# EAGLE design SuperPET OS9 MMU v2.0 (EAGLE 5.02)
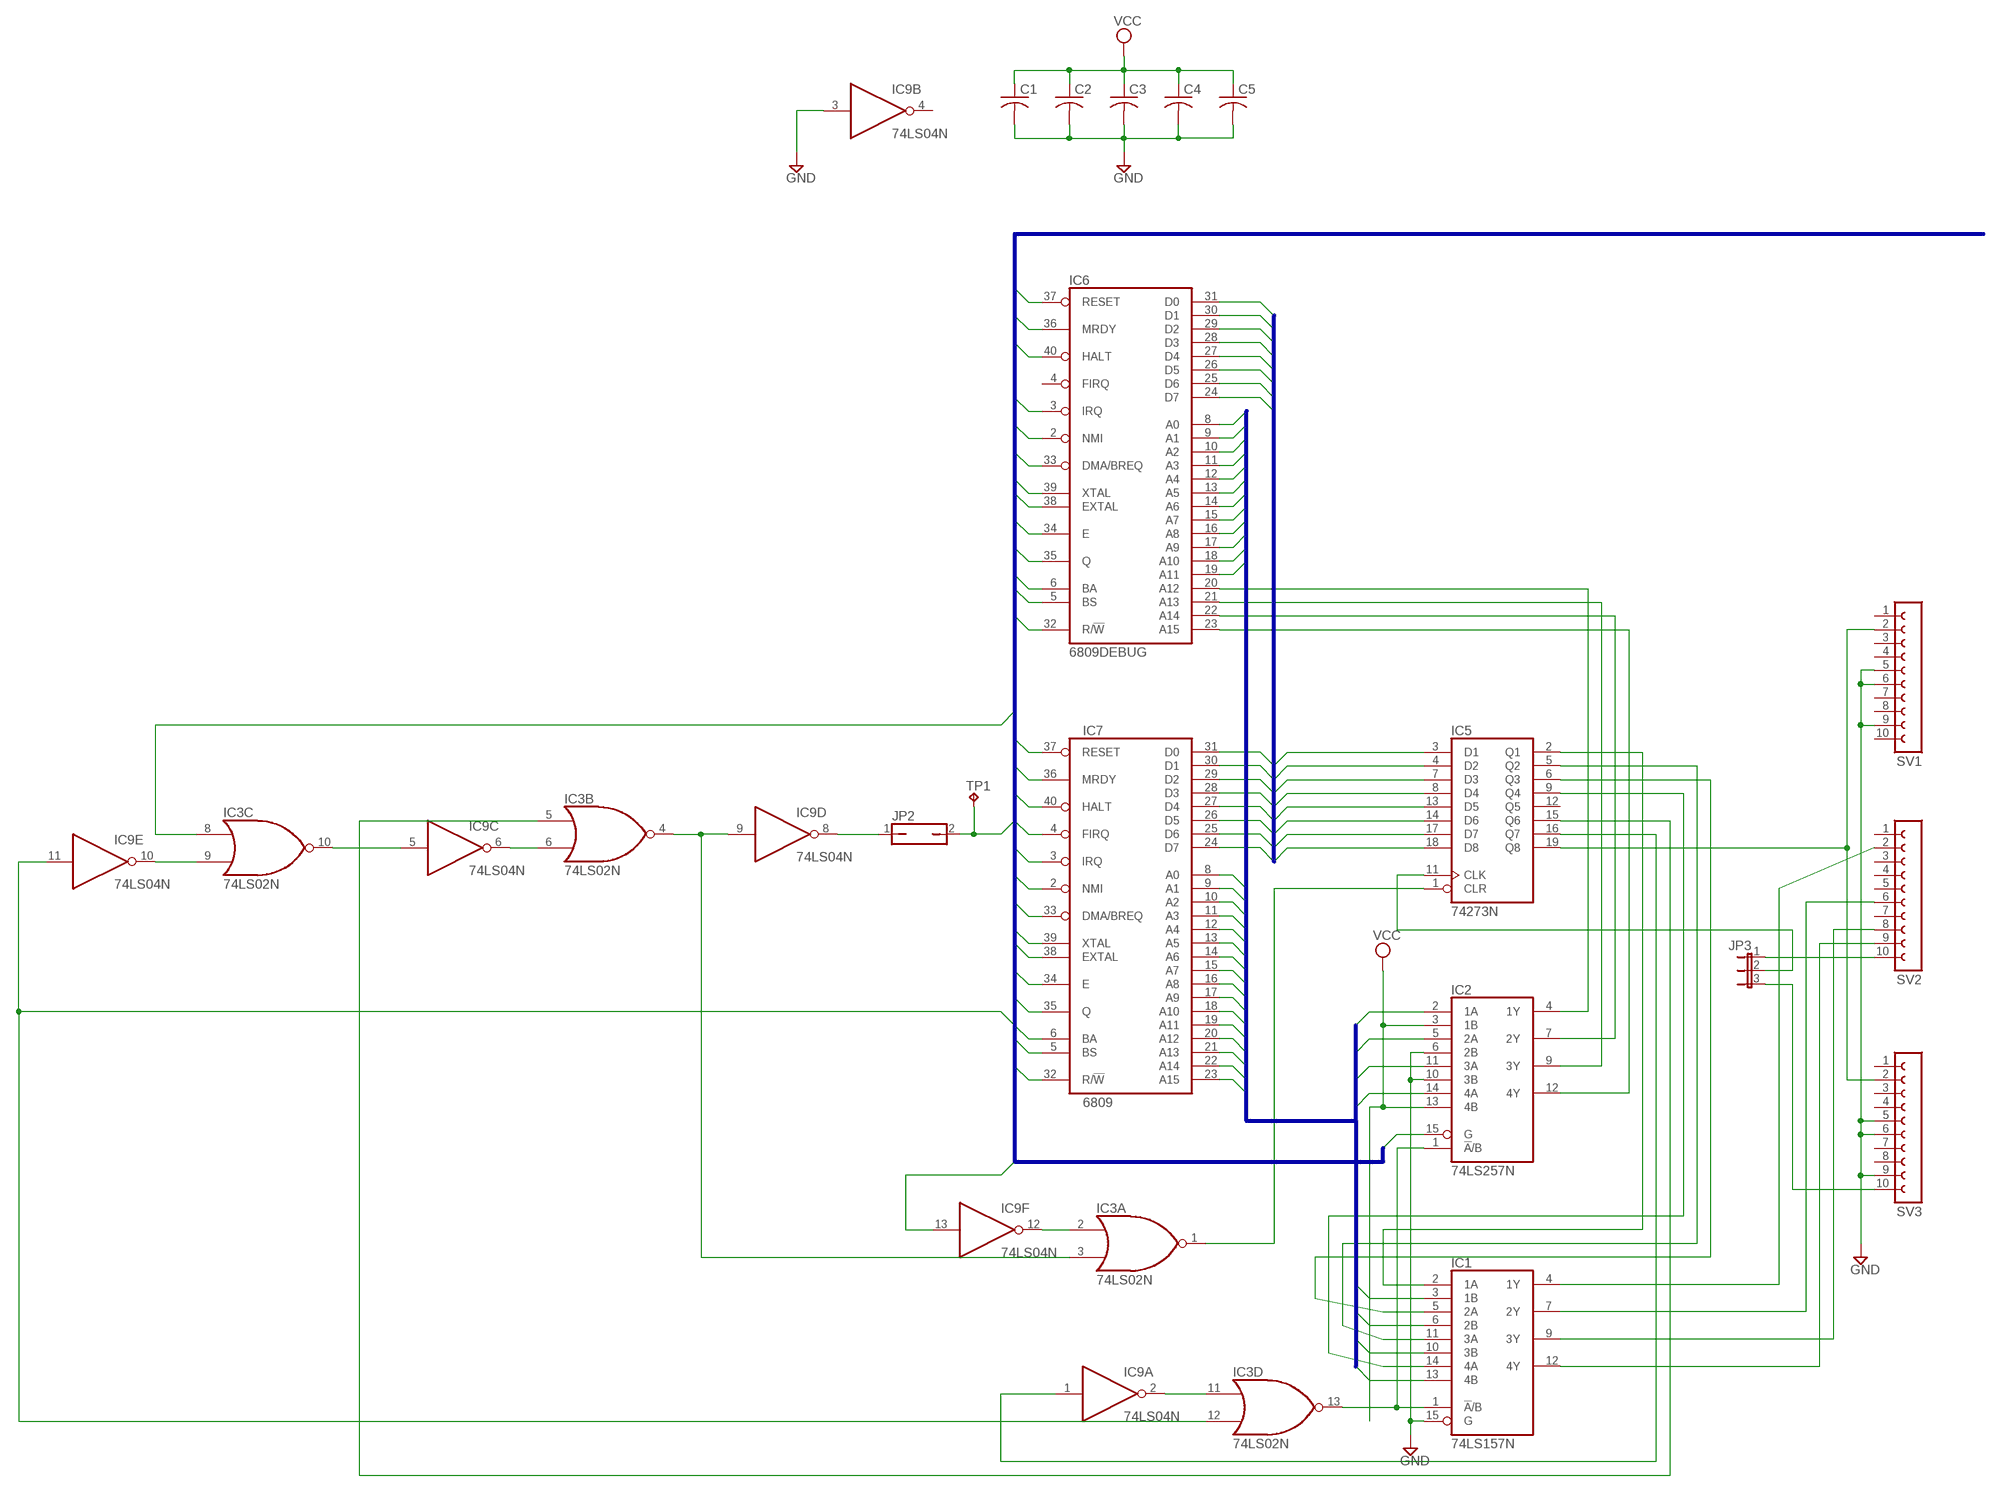
[diagram p0: schematic, sheet 1]

## Parts
C1  C-US025-025X050  [C025-025X050]
C2  C-US025-025X050  [C025-025X050]
C3  C-US025-025X050  [C025-025X050]
C4  C-US025-025X050  [C025-025X050]
C5  C-US025-025X050  [C025-025X050]
IC1  74LS157N  [DIL16]
IC2  74LS257N  [DIL16]
IC3  74LS02N  [DIL14]
IC5  74273N  [DIL20]
IC6  6809DEBUG  [DIL40]
IC7  6809  [DIL40]
IC9  74LS04N  [DIL14]
JP2  JP1Q  [JP1]
JP3  JP2E  [JP2]
SV1  FE10-1  [FE10]
SV2  FE10-1  [FE10]
SV3  FE10-1  [FE10]
TP1  TPPAD1-17  [P1-17]

## Nets
ADDR0: IC6.8(A0) IC7.8(A0)
ADDR1: IC6.9(A1) IC7.9(A1)
ADDR2: IC6.10(A2) IC7.10(A2)
ADDR3: IC6.11(A3) IC7.11(A3)
ADDR4: IC6.12(A4) IC7.12(A4)
ADDR5: IC6.13(A5) IC7.13(A5)
ADDR6: IC6.14(A6) IC7.14(A6)
ADDR7: IC6.15(A7) IC7.15(A7)
ADDR8: IC6.16(A8) IC7.16(A8)
ADDR9: IC6.17(A9) IC7.17(A9)
ADDR10: IC6.18(A10) IC7.18(A10)
ADDR11: IC6.19(A11) IC7.19(A11)
ADDR12: IC1.3(1B) IC2.2(1A) IC7.20(A12)
ADDR13: IC1.10(3B) IC2.11(3A) IC7.21(A13)
ADDR14: IC1.6(2B) IC2.5(2A) IC7.22(A14)
ADDR15: IC1.13(4B) IC2.14(4A) IC7.23(A15)
BA: IC2.15(G) IC3.12(D:I1) IC6.6(BA) IC7.6(BA) IC9.11(E:I)
BS: IC3.8(C:I0) IC6.5(BS) IC7.5(BS)
DATA0: IC5.3(D1) IC6.31(D0) IC7.31(D0)
DATA1: IC5.4(D2) IC6.30(D1) IC7.30(D1)
DATA2: IC5.7(D3) IC6.29(D2) IC7.29(D2)
DATA3: IC5.8(D4) IC6.28(D3) IC7.28(D3)
DATA4: IC5.13(D5) IC6.27(D4) IC7.27(D4)
DATA5: IC5.14(D6) IC6.26(D5) IC7.26(D5)
DATA6: IC5.17(D7) IC6.25(D6) IC7.25(D6)
DATA7: IC5.18(D8) IC6.24(D7) IC7.24(D7)
DMA: IC6.33(DMA/BREQ) IC7.33(DMA/BREQ)
E: IC6.34(E) IC7.34(E)
EXTAL: IC6.38(EXTAL) IC7.38(EXTAL)
FIRQ: IC7.4(FIRQ) JP2.2 TP1.1(TP)
GND: C1.2 C2.2 C3.2 C4.2 C5.2 IC1.15(G) IC2.6(2B) IC2.10(3B) IC9.3(B:I) SV1.5 SV1.6 SV1.9 SV3.5 SV3.6 SV3.9
HALT: IC6.40(HALT) IC7.40(HALT)
IRQ: IC6.3(IRQ) IC7.3(IRQ)
MRDY: IC6.36(MRDY) IC7.36(MRDY)
N$1: IC2.4(1Y) IC6.20(A12)
N$2: IC2.9(3Y) IC6.21(A13)
N$3: IC2.7(2Y) IC6.22(A14)
N$4: IC2.12(4Y) IC6.23(A15)
N$5: IC1.1(!A!/B) IC2.1(!A!/B) IC3.13(D:O)
N$6: IC3.1(A:O) IC5.1(CLR)
N$7: IC3.2(A:I0) IC9.12(F:O)
N$8: IC9.8(D:O) JP2.1
N$9: IC3.3(A:I1) IC3.4(B:O) IC9.9(D:I)
N$10: IC3.5(B:I0) IC5.15(Q6)
N$11: IC3.6(B:I1) IC9.6(C:O)
N$12: IC3.10(C:O) IC9.5(C:I)
N$13: IC3.9(C:I1) IC9.10(E:O)
N$14: IC3.11(D:I0) IC9.2(A:O)
N$15: IC5.16(Q7) IC9.1(A:I)
N$16: IC1.2(1A) IC5.2(Q1)
N$17: IC1.14(4A) IC5.9(Q4)
N$18: IC1.11(3A) IC5.5(Q2)
N$19: IC1.7(2Y) SV2.6
N$20: IC5.19(Q8) SV1.2 SV3.2
N$21: IC1.12(4Y) SV2.9
N$22: JP3.1 SV2.10
N$23: IC5.11(CLK) JP3.2
N$24: JP3.3 SV3.10
N$25: IC1.5(2A) IC5.6(Q3)
N$26: IC1.4(1Y) SV2.2
N$27: IC1.9(3Y) SV2.8
NMI: IC6.2(NMI) IC7.2(NMI)
Q: IC6.35(Q) IC7.35(Q)
R_W: IC6.32(R/!W) IC7.32(R/!W)
RESET: IC6.37(RESET) IC7.37(RESET) IC9.13(F:I)
VCC: C1.1 C2.1 C3.1 C4.1 C5.1 IC2.3(1B) IC2.13(4B)
XTAL: IC6.39(XTAL) IC7.39(XTAL)
Unconnected: IC5.12(Q5) IC6.4(FIRQ) IC9.4(B:O) SV1.1 SV1.3 SV1.4 SV1.7 SV1.8 SV1.10 SV2.1 SV2.3 SV2.4 SV2.5 SV2.7 SV3.1 SV3.3 SV3.4 SV3.7 SV3.8

## Buses
RESET,MRDY,HALT,FIRQ,IRQ,NMI,DMA,XTAL,EXTAL,E,Q,BA,BS,R_W
ADDR[0..15]
DATA[0..7]

## Power pins joined to a net without a drawn wire
GND: IC1.8(GND) IC2.8(GND) IC3.7(P:GND) IC5.10(GND) IC6.1(GND) IC7.1(GND) IC9.7(P:GND)
VCC: IC1.16(VCC) IC2.16(VCC) IC3.14(P:VCC) IC5.20(VCC) IC6.7(VCC) IC7.7(VCC) IC9.14(P:VCC)

## Library data of the parts
C1-C5 = rcl:C-US: CAPACITOR, American symbol
IC1 = 74xx-us:74*157: Quadruple 2-line to 1-line data SELECTOR/MULTIPLEXER
IC2 = 74xx-us:74*257: Quadruple 2-to 1 line data SELECTOR/MULTIPLEXER
IC3 = 74xx-us:74*02: Quad 2-input NOR gate
IC5 = 74xx-us:74*273: Octal D type FLIP FLOP, clear
IC6 = 0RB_Motorola:6809DEBUG: 6809 counterpart to enable to replace the CPU with a PCB
IC7 = 0RB_Motorola:6809: 6809 processor
IC9 = 74xx-us:74*04: Hex INVERTER
JP2 = jumper:JP1Q: JUMPER
JP3 = jumper:JP2E: JUMPER
SV1-SV3 = con-lsta:FE10-1: FEMALE HEADER
TP1 = testpad:TP: Test pad

## Board
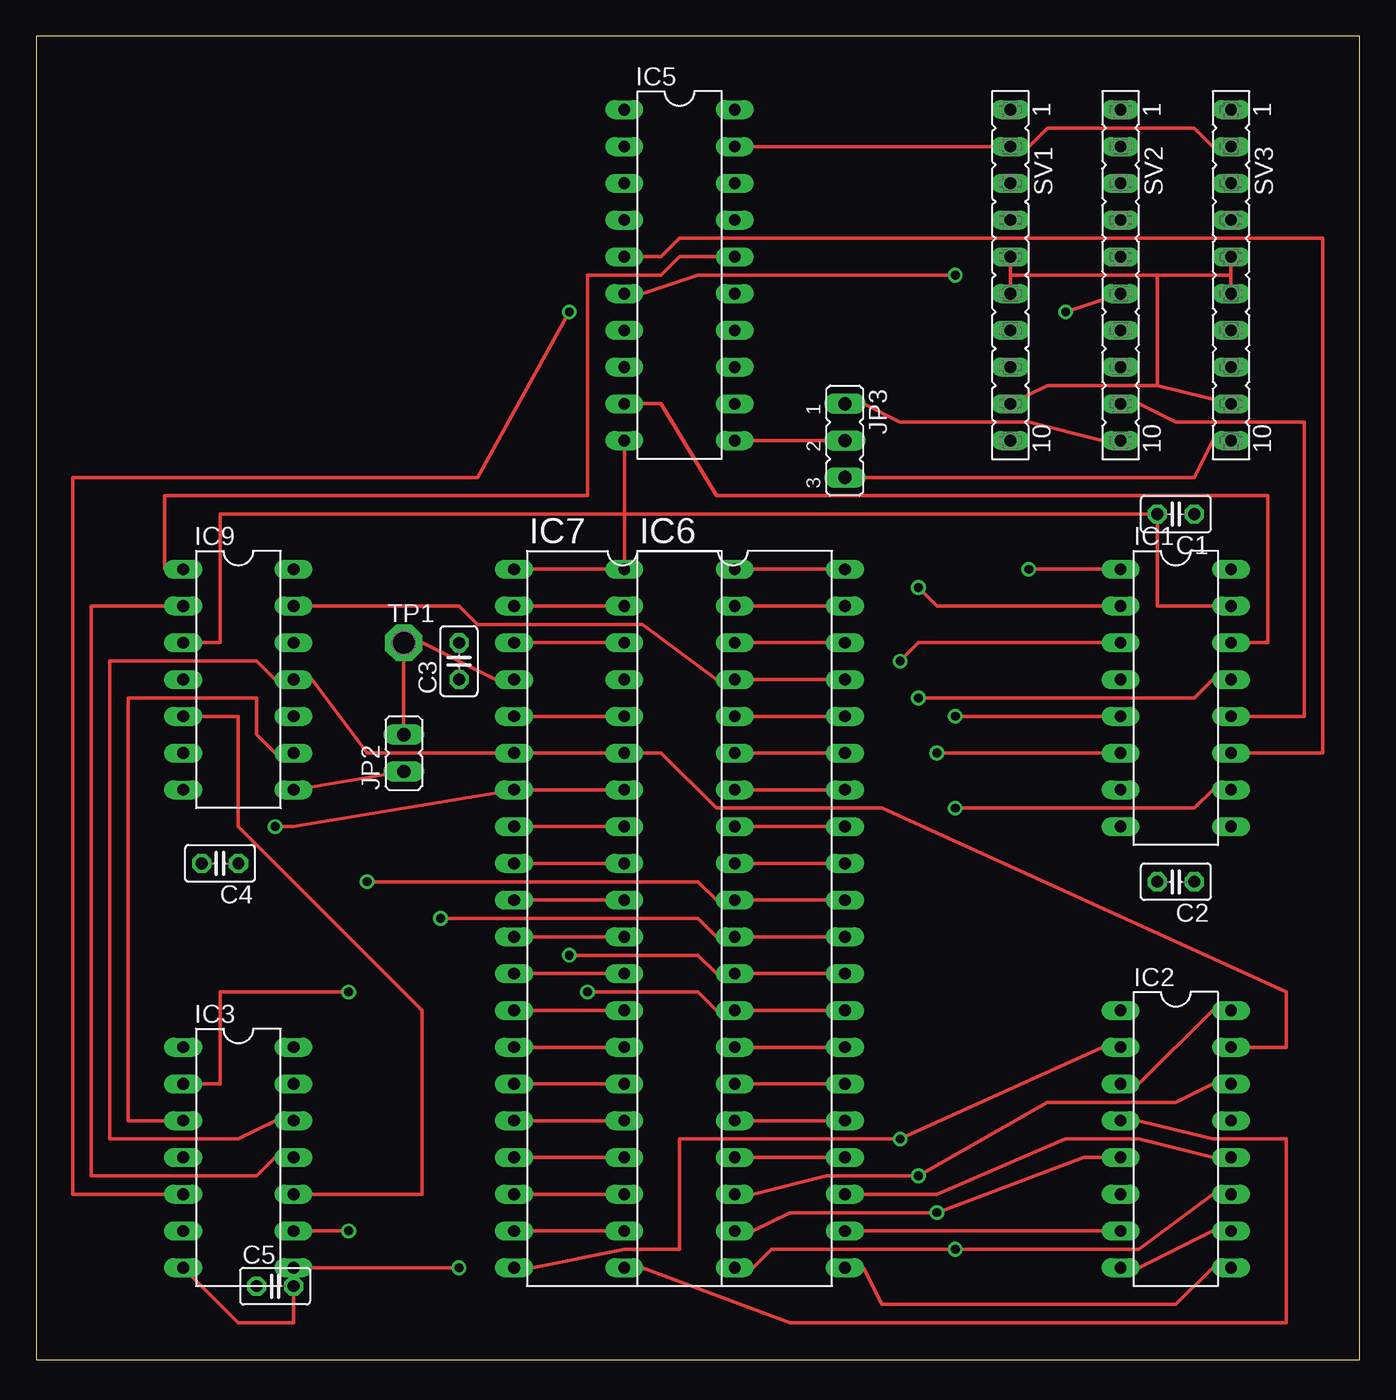
[diagram p1: board, top side]
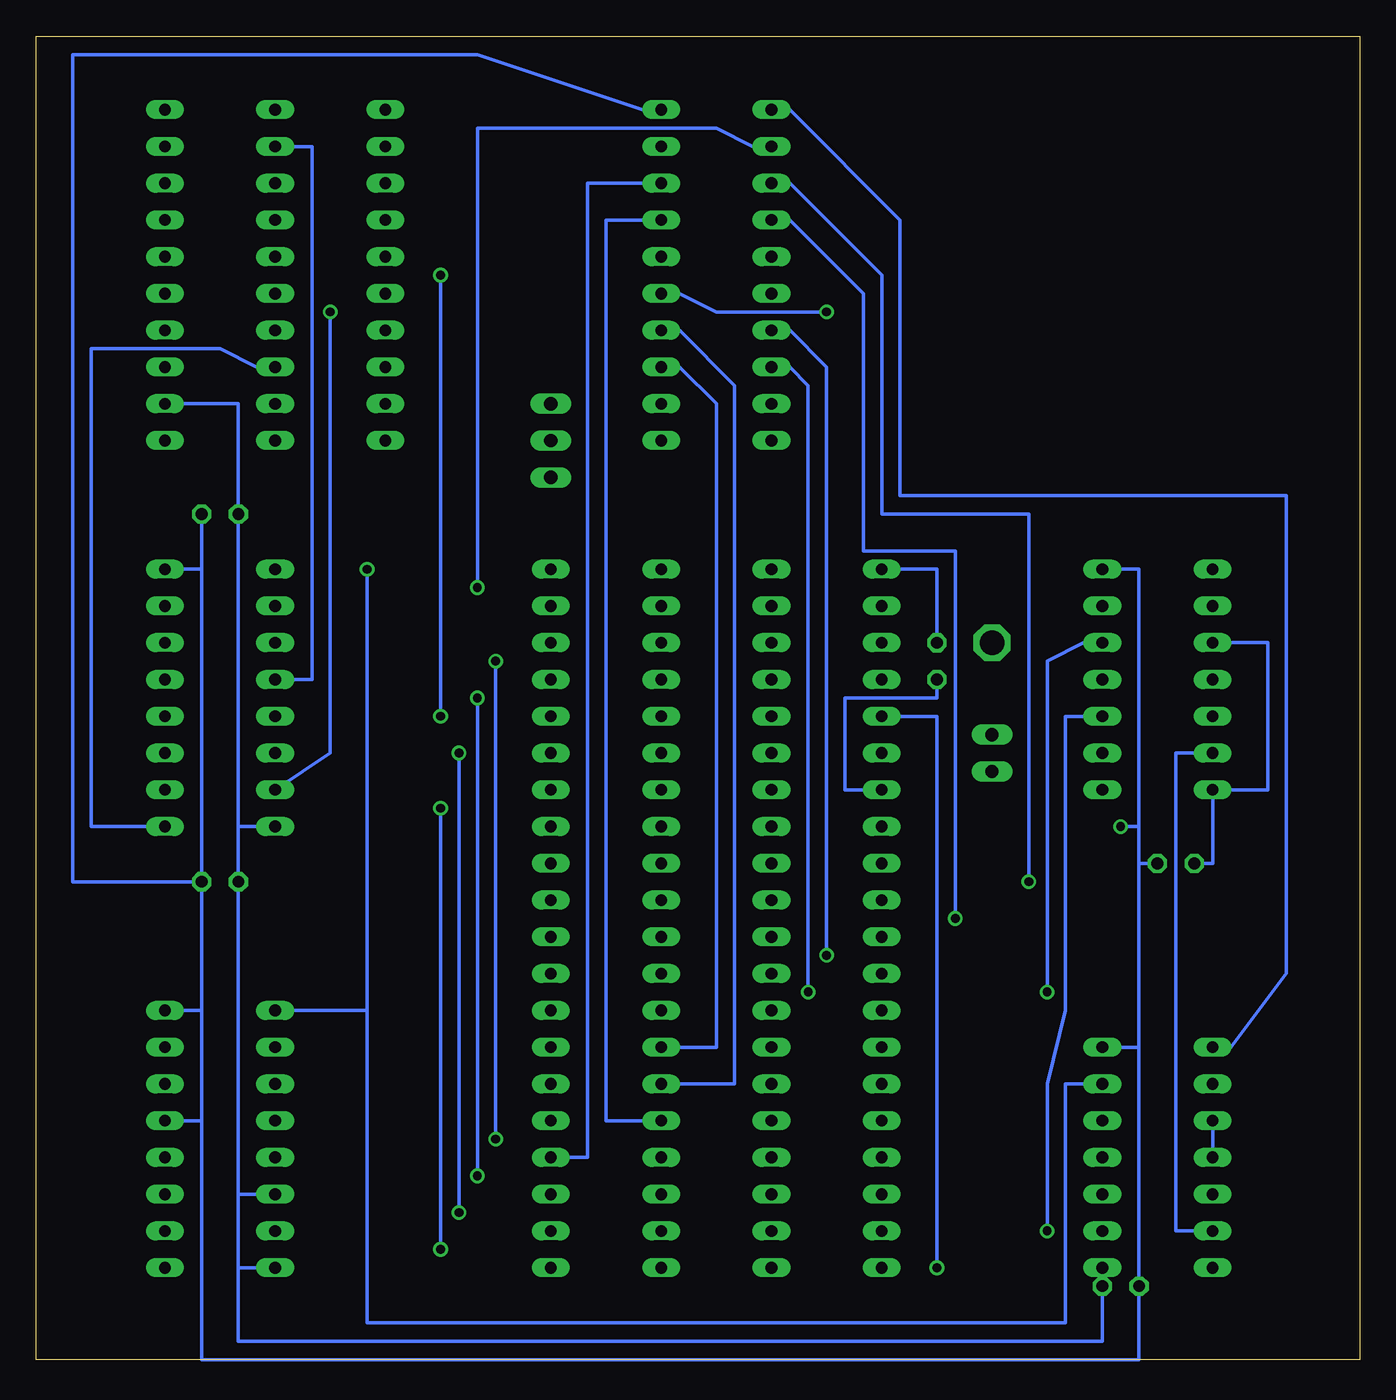
[diagram p2: board, bottom side, seen from below]

Size 91.44 x 91.44 mm. Coordinates in mm from the lower left corner, seen from the top.
Outline: 91.44,91.44 0,91.44 0,0 91.44,0 91.44,91.44
Copper layers (1*16): Top 0.035mm / dielectric 1.5mm / Bottom 0.035mm
Design rules "default": minimum track width 10mil, minimum drill 24mil, track to track 8mil, track to pad 8mil, pad to pad 8mil, via to via 8mil, smd to smd 8mil, copper to edge 40mil, drill to drill 8mil, minimum pad ring 10mil, minimum via ring 8mil, stop-mask expansion 4mil, vias tented up to drill 0mil, thermal gap 10mil

### Footprints (pad centres in the part's own frame; a part is rotated, then mirrored left to right if it is on the bottom)
C025-025X050 = drill 0.813 octagon: 1 -1.27,0; 2 1.27,0
DIL16 = drill 0.813 long: 1 -8.89,-3.81; 2 -6.35,-3.81; 3 -3.81,-3.81; 4 -1.27,-3.81; 5 1.27,-3.81; 6 3.81,-3.81; 7 6.35,-3.81; 8 8.89,-3.81; 9 8.89,3.81; 10 6.35,3.81; 11 3.81,3.81; 12 1.27,3.81; 13 -1.27,3.81; 14 -3.81,3.81; 15 -6.35,3.81; 16 -8.89,3.81
DIL14 = drill 0.813 long: 1 -7.62,-3.81; 2 -5.08,-3.81; 3 -2.54,-3.81; 4 0,-3.81; 5 2.54,-3.81; 6 5.08,-3.81; 7 7.62,-3.81; 8 7.62,3.81; 9 5.08,3.81; 10 2.54,3.81; 11 0,3.81; 12 -2.54,3.81; 13 -5.08,3.81; 14 -7.62,3.81
DIL20 = drill 0.813 long: 1 -11.43,-3.81; 2 -8.89,-3.81; 3 -6.35,-3.81; 4 -3.81,-3.81; 5 -1.27,-3.81; 6 1.27,-3.81; 7 3.81,-3.81; 8 6.35,-3.81; 9 8.89,-3.81; 10 11.43,-3.81; 11 11.43,3.81; 12 8.89,3.81; 13 6.35,3.81; 14 3.81,3.81; 15 1.27,3.81; 16 -1.27,3.81; 17 -3.81,3.81; 18 -6.35,3.81; 19 -8.89,3.81; 20 -11.43,3.81
DIL40 = drill 0.813 long: 1 -24.13,-7.62; 2 -21.59,-7.62; 3 -19.05,-7.62; 4 -16.51,-7.62; 5 -13.97,-7.62; 6 -11.43,-7.62; 7 -8.89,-7.62; 8 -6.35,-7.62; 9 -3.81,-7.62; 10 -1.27,-7.62; 11 1.27,-7.62; 12 3.81,-7.62; 13 6.35,-7.62; 14 8.89,-7.62; 15 11.43,-7.62; 16 13.97,-7.62; 17 16.51,-7.62; 18 19.05,-7.62; 19 21.59,-7.62; 20 24.13,-7.62; 21 24.13,7.62; 22 21.59,7.62; 23 19.05,7.62; 24 16.51,7.62; 25 13.97,7.62; 26 11.43,7.62; 27 8.89,7.62; 28 6.35,7.62; 29 3.81,7.62; 30 1.27,7.62; 31 -1.27,7.62; 32 -3.81,7.62; 33 -6.35,7.62; 34 -8.89,7.62; 35 -11.43,7.62; 36 -13.97,7.62; 37 -16.51,7.62; 38 -19.05,7.62; 39 -21.59,7.62; 40 -24.13,7.62
JP1 = drill 0.914 long: 1 0,-1.27; 2 0,1.27
JP2 = drill 0.914 long: 1 -2.54,0; 2 0,0; 3 2.54,0
FE10 = drill 0.813 long: 1 -11.43,0; 2 -8.89,0; 3 -6.35,0; 4 -3.81,0; 5 -1.27,0; 6 1.27,0; 7 3.81,0; 8 6.35,0; 9 8.89,0; 10 11.43,0
P1-17 = drill 1.702 pad 2.54 octagon: 1 0,0

### Placement (x,y rotation side)
C1  78.74,58.42 180 top
C2  78.74,33.02 180 top
C3  29.21,48.26 90 top
C4  12.7,34.29 180 top
C5  16.51,5.08 0 top
IC1  78.74,45.72 270 top
IC2  78.74,15.24 270 top
IC3  13.97,13.97 270 top
IC5  44.45,74.93 270 top
IC6  48.26,30.48 270 top
IC7  40.64,30.48 270 top
IC9  13.97,46.99 270 top
JP2  25.4,41.91 0 top
JP3  55.88,63.5 270 top
SV1  67.31,74.93 270 top
SV2  74.93,74.93 270 top
SV3  82.55,74.93 270 top
TP1  25.4,49.53 0 top

### Tracks (layer width: path | path; a pad name or v marks a point on that pad's centre or on a via)
ADDR0
  Top 0.254: IC7.8 IC6.8
ADDR1
  Top 0.254: IC7.9 IC6.9
ADDR2
  Top 0.254: IC7.10 IC6.10
ADDR3
  Top 0.254: IC7.11 IC6.11
ADDR4
  Top 0.254: IC7.12 IC6.12
ADDR5
  Top 0.254: IC7.13 IC6.13
ADDR6
  Top 0.254: IC7.14 IC6.14
ADDR7
  Top 0.254: IC7.15 IC6.15
ADDR8
  Top 0.254: IC7.16 IC6.16
ADDR9
  Top 0.254: IC7.17 IC6.17
ADDR10
  Top 0.254: IC7.18 IC6.18
ADDR11
  Top 0.254: IC7.19 IC6.19
ADDR12  (via drill 0.61)
  Top 0.254: IC7.20 34.29,6.35 40.64,7.62 44.45,7.62 44.45,15.24 v59.69,15.24 73.66,21.59 IC2.2 | IC1.3 60.96,49.53 v59.69,48.26
  Bottom 0.254: v59.69,15.24 v59.69,48.26
ADDR13  (via drill 0.61)
  Top 0.254: IC7.21 49.53,6.35 50.8,7.62 v63.5,7.62 76.2,7.62 81.28,11.43 IC2.11 | IC1.10 81.28,39.37 80.01,38.1 v63.5,38.1
  Bottom 0.254: v63.5,7.62 v63.5,38.1
ADDR14  (via drill 0.61)
  Top 0.254: IC7.22 49.53,8.89 52.07,10.16 v62.23,10.16 72.39,13.97 IC2.5 | v62.23,41.91 IC1.6
  Bottom 0.254: v62.23,10.16 v62.23,41.91
ADDR15  (via drill 0.61)
  Top 0.254: IC7.23 49.53,11.43 54.61,12.7 v60.96,12.7 69.85,17.78 78.74,17.78 81.28,19.05 IC2.14 | IC1.13 81.28,46.99 80.01,45.72 v60.96,45.72
  Bottom 0.254: v60.96,12.7 v60.96,45.72
BA
  Top 0.254: IC2.15 86.36,21.59 86.36,25.4 58.42,38.1 46.99,38.1 43.18,41.91 IC6.6 IC7.6 22.86,41.91 19.05,46.99 IC9.11 16.51,46.99 15.24,48.26 5.08,48.26 5.08,15.24 13.97,15.24 16.51,16.51 IC3.12
BS  (via drill 0.61)
  Top 0.254: IC7.5 IC6.5 | IC3.8 v29.21,6.35
  Bottom 0.254: v29.21,6.35 29.21,44.45 IC7.5
DATA0  (via drill 0.61)
  Top 0.254: IC6.31 IC7.31 46.99,31.75 45.72,33.02 v22.86,33.02
  Bottom 0.254: IC5.3 39.37,81.28 33.02,74.93 33.02,58.42 22.86,58.42 v22.86,33.02
DATA1  (via drill 0.61)
  Top 0.254: IC6.30 IC7.30 46.99,29.21 45.72,30.48 v27.94,30.48
  Bottom 0.254: IC5.4 39.37,78.74 34.29,73.66 34.29,55.88 27.94,55.88 v27.94,30.48
DATA2  (via drill 0.61)
  Top 0.254: IC6.29 IC7.29 46.99,26.67 45.72,27.94 v36.83,27.94
  Bottom 0.254: IC5.7 39.37,71.12 36.83,68.58 v36.83,27.94
DATA3  (via drill 0.61)
  Top 0.254: IC6.28 IC7.28 46.99,24.13 45.72,25.4 v38.1,25.4
  Bottom 0.254: IC5.8 39.37,68.58 38.1,67.31 v38.1,25.4
DATA4
  Top 0.254: IC7.27 IC6.27
  Bottom 0.254: IC5.13 46.99,68.58 44.45,66.04 44.45,21.59 IC7.27
DATA5
  Top 0.254: IC7.26 IC6.26
  Bottom 0.254: IC5.14 46.99,71.12 43.18,67.31 43.18,19.05 IC7.26
DATA6
  Top 0.254: IC7.25 IC6.25
  Bottom 0.254: IC5.17 52.07,78.74 52.07,16.51 IC7.25
DATA7
  Top 0.254: IC7.24 IC6.24
  Bottom 0.254: IC5.18 53.34,81.28 53.34,13.97 IC6.24
DMA
  Top 0.254: IC7.33 IC6.33
E
  Top 0.254: IC7.34 IC6.34
EXTAL
  Top 0.254: IC7.38 IC6.38
FIRQ
  Top 0.254: IC7.4 31.75,46.99 26.67,49.53 TP1.1 JP2.2
GND
  Top 0.254: 40.64,58.42 IC6.1 IC7.1 | 40.64,58.42 IC5.10 | IC2.8 76.2,6.35 81.28,8.89 IC2.10 | IC9.3 12.7,49.53 12.7,58.42 40.64,58.42 | 40.64,58.42 C1.2 77.47,52.07 IC1.15 | IC3.7 13.97,2.54 17.78,2.54 C5.2 | 67.31,74.93 SV1.6 | 67.31,74.93 SV1.5 | 77.47,74.93 67.31,74.93 | 77.47,74.93 82.55,74.93 | 82.55,74.93 SV3.5 | 82.55,74.93 SV3.6 | SV1.9 69.85,67.31 77.47,67.31 | 77.47,67.31 77.47,74.93 | SV3.9 77.47,67.31
  Bottom 0.254: IC7.1 29.21,54.61 C3.2 | C4.2 10.16,34.29 IC9.7 6.35,39.37 6.35,49.53 IC9.3 | 77.47,11.43 IC2.6 | 77.47,6.35 77.47,11.43 | 77.47,6.35 IC2.8 | 77.47,11.43 C2.2 77.47,36.83 | 77.47,36.83 IC1.8 | 77.47,36.83 C1.2 77.47,66.04 SV3.9 | 77.47,6.35 77.47,1.27 17.78,1.27 C5.2
HALT
  Top 0.254: IC7.40 IC6.40
IRQ
  Top 0.254: IC7.3 IC6.3
MRDY
  Top 0.254: IC7.36 IC6.36
N$1
  Top 0.254: IC6.20 41.91,6.35 52.07,2.54 86.36,2.54 86.36,15.24 81.28,15.24 76.2,16.51 IC2.4
N$2
  Top 0.254: IC6.21 57.15,6.35 58.42,3.81 78.74,3.81 81.28,6.35 IC2.9
N$3
  Top 0.254: IC6.22 IC2.7
N$4
  Top 0.254: IC6.23 62.23,11.43 71.12,15.24 76.2,15.24 81.28,13.97 IC2.12
N$5  (via drill 0.61)
  Top 0.254: v68.58,54.61 IC1.1
  Bottom 0.254: 68.58,24.13 v68.58,54.61 | 68.58,24.13 IC2.1 | IC3.13 20.32,19.05 20.32,2.54 68.58,2.54 68.58,24.13
N$6
  Bottom 0.254: IC3.1 8.89,21.59 5.08,26.67 5.08,59.69 31.75,59.69 31.75,78.74 39.37,86.36 IC5.1
N$7  (via drill 0.61)
  Top 0.254: v21.59,25.4 12.7,25.4 12.7,19.05 IC3.2
  Bottom 0.254: IC9.12 19.05,49.53 21.59,48.26 v21.59,25.4
N$8
  Top 0.254: IC9.8 JP2.1
N$9
  Top 0.254: IC9.9 16.51,41.91 15.24,43.18 15.24,45.72 6.35,45.72 6.35,16.51 IC3.3
  Bottom 0.254: IC3.3 IC3.4
N$10  (via drill 0.61)
  Top 0.254: IC3.5 2.54,11.43 2.54,60.96 30.48,60.96 v36.83,72.39
  Bottom 0.254: v36.83,72.39 44.45,72.39 46.99,73.66 IC5.15
N$11
  Bottom 0.254: IC9.6 12.7,41.91 12.7,8.89 IC3.6
N$12
  Top 0.254: IC9.5 13.97,44.45 13.97,36.83 26.67,24.13 26.67,11.43 IC3.10
N$13  (via drill 0.61)
  Top 0.254: IC3.9 v21.59,8.89
  Bottom 0.254: IC9.10 20.32,44.45 20.32,24.13 21.59,19.05 v21.59,8.89
N$14
  Top 0.254: IC9.2 3.81,52.07 3.81,12.7 15.24,12.7 16.51,13.97 IC3.11
N$15
  Top 0.254: IC9.1 8.89,54.61 8.89,59.69 38.1,59.69 38.1,74.93 43.18,74.93 44.45,76.2 IC5.16
N$16  (via drill 0.61)
  Top 0.254: v60.96,53.34 62.23,52.07 IC1.2
  Bottom 0.254: IC5.2 41.91,83.82 44.45,85.09 60.96,85.09 v60.96,53.34
N$17
  Top 0.254: IC5.9 43.18,66.04 46.99,59.69 85.09,59.69 85.09,49.53 IC1.14
N$18
  Top 0.254: IC5.5 43.18,76.2 44.45,77.47 88.9,77.47 88.9,41.91 IC1.11
N$19  (via drill 0.61)
  Top 0.254: v71.12,72.39 SV2.6
  Bottom 0.254: v71.12,72.39 71.12,41.91 IC1.7
N$20
  Top 0.254: IC5.19 SV1.2 68.58,83.82 69.85,85.09 80.01,85.09 81.28,83.82 SV3.2
N$21
  Top 0.254: SV2.9 76.2,66.04 78.74,64.77 87.63,64.77 87.63,44.45 IC1.12
N$22
  Top 0.254: JP3.1 57.15,66.04 59.69,64.77 68.58,64.77 73.66,63.5 SV2.10
N$23
  Top 0.254: IC5.11 JP3.2
N$24
  Top 0.254: SV3.10 81.28,63.5 80.01,60.96 JP3.3
N$25  (via drill 0.61)
  Top 0.254: v63.5,44.45 IC1.5 | v63.5,74.93 45.72,74.93 41.91,73.66 IC5.6
  Bottom 0.254: v63.5,44.45 v63.5,74.93
N$26
  Bottom 0.254: SV2.2 72.39,83.82 72.39,46.99 IC1.4
N$27
  Bottom 0.254: SV2.8 76.2,68.58 78.74,69.85 87.63,69.85 87.63,36.83 IC1.9
NMI
  Top 0.254: IC7.2 IC6.2
Q
  Top 0.254: IC7.35 IC6.35
R_W
  Top 0.254: IC7.32 IC6.32
RESET
  Top 0.254: IC6.37 IC7.37 46.99,46.99 41.91,50.8 30.48,50.8 29.21,52.07 IC9.13
VCC  (via drill 0.61)
  Top 0.254: IC6.7 IC7.7 17.78,36.83 v16.51,36.83 | IC2.3 76.2,19.05 81.28,24.13 IC2.16
  Bottom 0.254: C3.1 29.21,45.72 35.56,45.72 35.56,39.37 IC7.7 | IC9.14 15.24,54.61 15.24,36.83 | 15.24,34.29 15.24,36.83 | 15.24,34.29 C4.1 | 15.24,21.59 15.24,34.29 | 15.24,21.59 IC3.14 | 15.24,36.83 v16.51,36.83 | 80.01,16.51 IC2.13 | 80.01,16.51 80.01,24.13 | 80.01,24.13 IC2.16 | 80.01,24.13 C2.1 | C2.1 80.01,54.61 | 80.01,54.61 C1.1 | 80.01,54.61 IC1.16 | 80.01,16.51 80.01,0 15.24,0 C5.1 15.24,21.59 | IC5.20 49.53,86.36 60.96,90.17 88.9,90.17 88.9,33.02 C2.1
XTAL
  Top 0.254: IC7.39 IC6.39